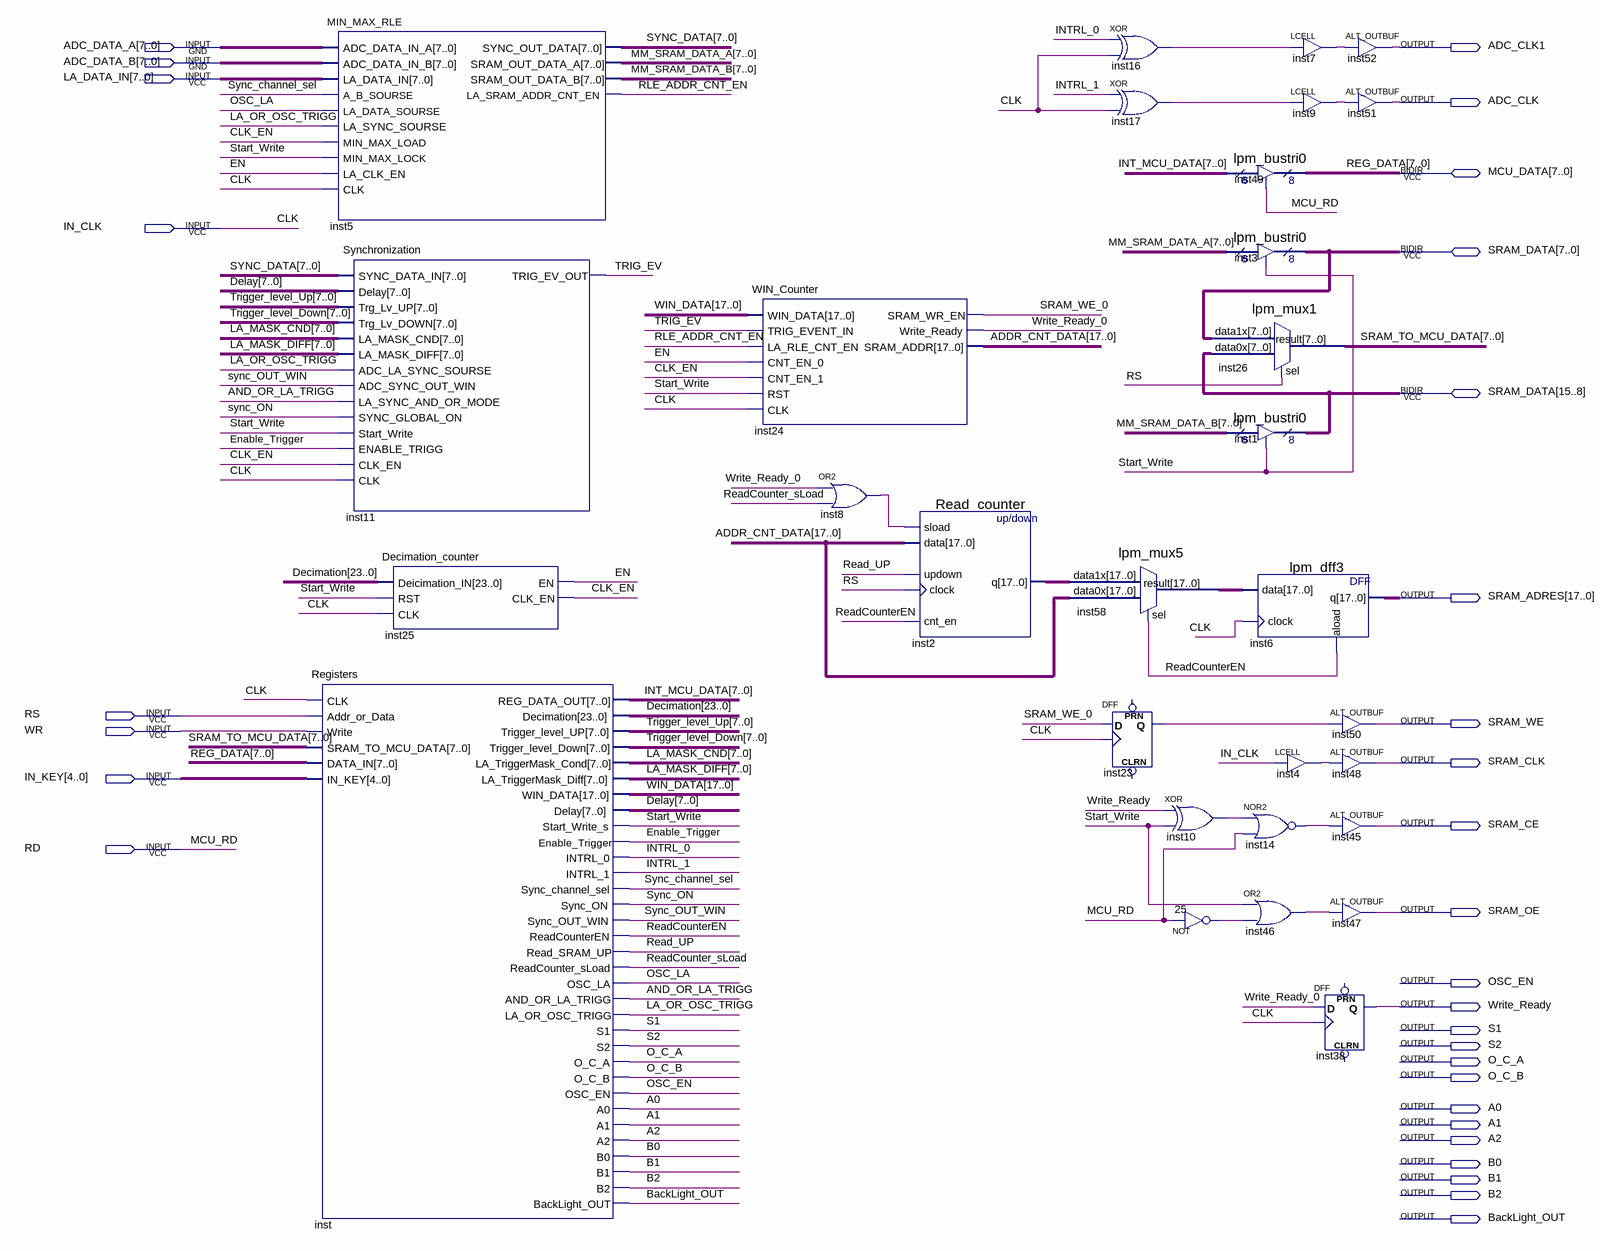
[diagram p0: schematic sheet]
// Quartus schematic NS3.bdf as structural Verilog: 30 symbols, 31 pins
module NS3 (
  input  [7:0] ADC_DATA_A,
  input  [7:0] ADC_DATA_B,
  input  [7:0] LA_DATA_IN,
  input  IN_CLK,
  input  RS,
  input  WR,
  input  [4:0] IN_KEY,
  input  RD,
  inout  [7:0] MCU_DATA,
  inout  [15:0] SRAM_DATA,
  output ADC_CLK1,
  output ADC_CLK,
  output [17:0] SRAM_ADRES,
  output SRAM_WE,
  output SRAM_CLK,
  output SRAM_CE,
  output SRAM_OE,
  output OSC_EN,
  output Write_Ready,
  output S1,
  output S2,
  output O_C_A,
  output O_C_B,
  output A0,
  output A1,
  output A2,
  output B0,
  output B1,
  output B2,
  output BackLight_OUT
);

  wire AND_OR_LA_TRIGG, CLK_EN, EN, Enable_Trigger, inst4_out, inst7_out, inst8_out, inst9_out, inst10_out,
       inst14_out, inst16_out, inst17_out, inst23_q, inst46_out, INTRL_0, INTRL_1, LA_OR_OSC_TRIGG, n25_out,
       OSC_LA, Read_UP, ReadCounter_sLoad, ReadCounterEN, RLE_ADDR_CNT_EN, SRAM_WE_0, Start_Write,
       Sync_channel_sel, Sync_ON, Sync_OUT_WIN, TRIG_EV, Write_Ready_0;
  wire [7:0] Delay, INT_MCU_DATA, LA_MASK_CND, LA_MASK_DIFF, MM_SRAM_DATA_A, MM_SRAM_DATA_B,
       SRAM_TO_MCU_DATA, SYNC_DATA, Trigger_level_Down, Trigger_level_Up;
  wire [17:0] ADDR_CNT_DATA, inst2_q, inst58_result, WIN_DATA;
  wire [23:0] Decimation;

  Registers inst (
    .CLK(IN_CLK), .Addr_or_Data(RS), .Write(WR), .SRAM_TO_MCU_DATA(SRAM_TO_MCU_DATA), .DATA_IN(MCU_DATA),
    .IN_KEY(IN_KEY), .REG_DATA_OUT(INT_MCU_DATA), .Decimation(Decimation),
    .Trigger_level_UP(Trigger_level_Up), .Trigger_level_Down(Trigger_level_Down),
    .LA_TriggerMask_Cond(LA_MASK_CND), .LA_TriggerMask_Diff(LA_MASK_DIFF), .WIN_DATA(WIN_DATA),
    .Delay(Delay), .Start_Write_s(Start_Write), .Enable_Trigger(Enable_Trigger), .INTRL_0(INTRL_0),
    .INTRL_1(INTRL_1), .Sync_channel_sel(Sync_channel_sel), .Sync_ON(Sync_ON), .Sync_OUT_WIN(Sync_OUT_WIN),
    .ReadCounterEN(ReadCounterEN), .Read_SRAM_UP(Read_UP), .ReadCounter_sLoad(ReadCounter_sLoad),
    .OSC_LA(OSC_LA), .AND_OR_LA_TRIGG(AND_OR_LA_TRIGG), .LA_OR_OSC_TRIGG(LA_OR_OSC_TRIGG), .S1(S1), .S2(S2),
    .O_C_A(O_C_A), .O_C_B(O_C_B), .OSC_EN(OSC_EN), .A0(A0), .A1(A1), .A2(A2), .B0(B0), .B1(B1), .B2(B2),
    .BackLight_OUT(BackLight_OUT));
  MIN_MAX_RLE inst5 (
    .ADC_DATA_IN_A(ADC_DATA_A), .ADC_DATA_IN_B(ADC_DATA_B), .LA_DATA_IN(LA_DATA_IN),
    .A_B_SOURSE(Sync_channel_sel), .LA_DATA_SOURSE(OSC_LA), .LA_SYNC_SOURSE(LA_OR_OSC_TRIGG),
    .MIN_MAX_LOAD(CLK_EN), .MIN_MAX_LOCK(Start_Write), .LA_CLK_EN(EN), .CLK(IN_CLK),
    .SYNC_OUT_DATA(SYNC_DATA), .SRAM_OUT_DATA_A(MM_SRAM_DATA_A), .SRAM_OUT_DATA_B(MM_SRAM_DATA_B),
    .LA_SRAM_ADDR_CNT_EN(RLE_ADDR_CNT_EN));
  Synchronization inst11 (
    .SYNC_DATA_IN(SYNC_DATA), .Delay(Delay), .Trg_Lv_UP(Trigger_level_Up), .Trg_Lv_DOWN(Trigger_level_Down),
    .LA_MASK_CND(LA_MASK_CND), .LA_MASK_DIFF(LA_MASK_DIFF), .ADC_LA_SYNC_SOURSE(LA_OR_OSC_TRIGG),
    .ADC_SYNC_OUT_WIN(Sync_OUT_WIN), .LA_SYNC_AND_OR_MODE(AND_OR_LA_TRIGG), .SYNC_GLOBAL_ON(Sync_ON),
    .Start_Write(Start_Write), .ENABLE_TRIGG(Enable_Trigger), .CLK_EN(CLK_EN), .CLK(IN_CLK),
    .TRIG_EV_OUT(TRIG_EV));
  Decimation_counter inst25 (.Deicimation_IN(Decimation), .RST(Start_Write), .CLK(IN_CLK), .EN(EN), .CLK_EN(CLK_EN));
  WIN_Counter inst24 (
    .WIN_DATA(WIN_DATA), .TRIG_EVENT_IN(TRIG_EV), .LA_RLE_CNT_EN(RLE_ADDR_CNT_EN), .CNT_EN_0(EN),
    .CNT_EN_1(CLK_EN), .RST(Start_Write), .CLK(IN_CLK), .SRAM_WR_EN(SRAM_WE_0), .Write_Ready(Write_Ready_0),
    .SRAM_ADDR(ADDR_CNT_DATA));
  or inst8 (inst8_out, Write_Ready_0, ReadCounter_sLoad);
  Read_counter inst2 (
    .sload(inst8_out), .data(ADDR_CNT_DATA), .updown(Read_UP), .clock(RS), .cnt_en(ReadCounterEN), .q(inst2_q));
  lpm_mux5 inst58 (.data1x(inst2_q), .data0x(ADDR_CNT_DATA), .sel(ReadCounterEN), .result(inst58_result));
  xor inst16 (inst16_out, INTRL_0, IN_CLK);
  xor inst17 (inst17_out, INTRL_1, IN_CLK);
  DFF inst23 (.CLK(IN_CLK), .D(SRAM_WE_0), .Q(inst23_q));  // open: CLRN, PRN
  xor inst10 (inst10_out, Write_Ready, Start_Write);
  not u_25 (n25_out, RD);
  lpm_bustri0 inst49 (.enabledt(RD), .data(INT_MCU_DATA), .tridata(MCU_DATA));
  lpm_bustri0 inst3 (.enabledt(Start_Write), .data(MM_SRAM_DATA_A), .tridata(SRAM_DATA[7:0]));
  lpm_mux1 inst26 (.data1x(SRAM_DATA[7:0]), .data0x(SRAM_DATA[15:8]), .sel(RS), .result(SRAM_TO_MCU_DATA));
  lpm_bustri0 inst1 (.enabledt(Start_Write), .data(MM_SRAM_DATA_B), .tridata(SRAM_DATA[15:8]));
  lpm_dff3 inst6 (.data(inst58_result), .clock(IN_CLK), .aload(ReadCounterEN), .q(SRAM_ADRES));
  nor inst14 (inst14_out, inst10_out, RD);
  or inst46 (inst46_out, Start_Write, n25_out);
  LCELL inst7 (.IN(inst16_out), .OUT(inst7_out));
  LCELL inst9 (.IN(inst17_out), .OUT(inst9_out));
  LCELL inst4 (.IN(IN_CLK), .OUT(inst4_out));
  DFF inst38 (.CLK(IN_CLK), .D(Write_Ready_0), .Q(Write_Ready));  // open: CLRN, PRN
  ALT_OUTBUF inst52 (.i(inst7_out), .o(ADC_CLK1));
  ALT_OUTBUF inst51 (.i(inst9_out), .o(ADC_CLK));
  ALT_OUTBUF inst50 (.i(inst23_q), .o(SRAM_WE));
  ALT_OUTBUF inst48 (.i(inst4_out), .o(SRAM_CLK));
  ALT_OUTBUF inst45 (.i(inst14_out), .o(SRAM_CE));
  ALT_OUTBUF inst47 (.i(inst46_out), .o(SRAM_OE));

  // Other names for the same wires on the sheet: CLK = IN_CLK; MCU_RD = RD; REG_DATA[7:0] = MCU_DATA
endmodule
